# Altium schematic sheet Glucometer-I.C.- RF Module V4.SchDoc
size Letter
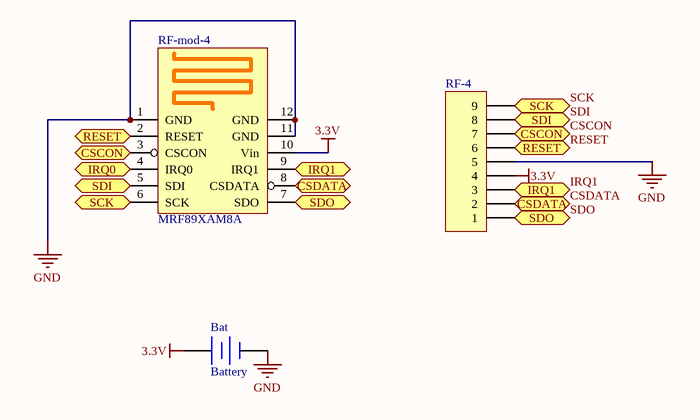
[diagram p0: Glucometer-I.C.- RF Module V4.SchDoc]

## Parts
Bat  Battery  [CR2032 Coin Holder]
RF-4  Header 9  [HDR1X9]  (value not drawn)
RF-mod-4  MRF89XAM8A  [MRF89XAM8A]

## Ports
CSCON, CSDATA, IRQ0, IRQ1, RESET, SCK, SDI, SDO

## Nets
3.3V: Bat.1(+) RF-4.4 RF-mod-4.10(Vin)
GND: Bat.2(-) RF-4.5 RF-mod-4.1(GND) RF-mod-4.11(GND) RF-mod-4.12(GND)
CSCON: RF-4.7 RF-mod-4.3(CSCON) ; port CSCON
CSDATA: RF-4.2 RF-mod-4.8(CSDATA) ; port CSDATA
IRQ0: RF-mod-4.4(IRQ0) ; port IRQ0
IRQ1: RF-4.3 RF-mod-4.9(IRQ1) ; port IRQ1
RESET: RF-4.6 RF-mod-4.2(RESET) ; port RESET
SCK: RF-4.9 RF-mod-4.6(SCK) ; port SCK
SDI: RF-4.8 RF-mod-4.5(SDI) ; port SDI
SDO: RF-4.1 RF-mod-4.7(SDO) ; port SDO

## Library data of the parts
Bat = Battery: Multicell Battery; Published: 24-Mar-1999; LatestRevisionDate: 17-Jul-2002; LatestRevisionNote: Re-released for DXP Platform.; PackageReference: BAT-2; Publisher: Altium Limited; PackageDescription: Battery; 2 Leads
RF-4 = Header 9: Header, 9-Pin; LatestRevisionDate: 17-Jul-2002; LatestRevisionNote: Re-released for DXP Platform.; Publisher: Altium Limited
RF-mod-4 = MRF89XAM8A: RF Module. 868MHz Ultra Low Power Sub-Ghz Transceiver Module